# Altium schematic sheet Actuators.SchDoc: Actuators
size A4; Author: Pedro Trenado & Ignacio Cabrera; DrawnBy: Pedro & Ignacio; SheetNumber: 4; Company: ETSI Telecomunicaciones; Address_City: Madrid; Address_Country: Spain; Address_Phone: 910 67 19 00; Address_State_ZIP: 28040; Address_Street: Av. Complutense, 30; TotalSheet: 5; VersionRevision: 1.0; Address_Website: https://www.etsist.upm.es; #NAME@: pedro.trenado@alumnos.upm.es; License: Student
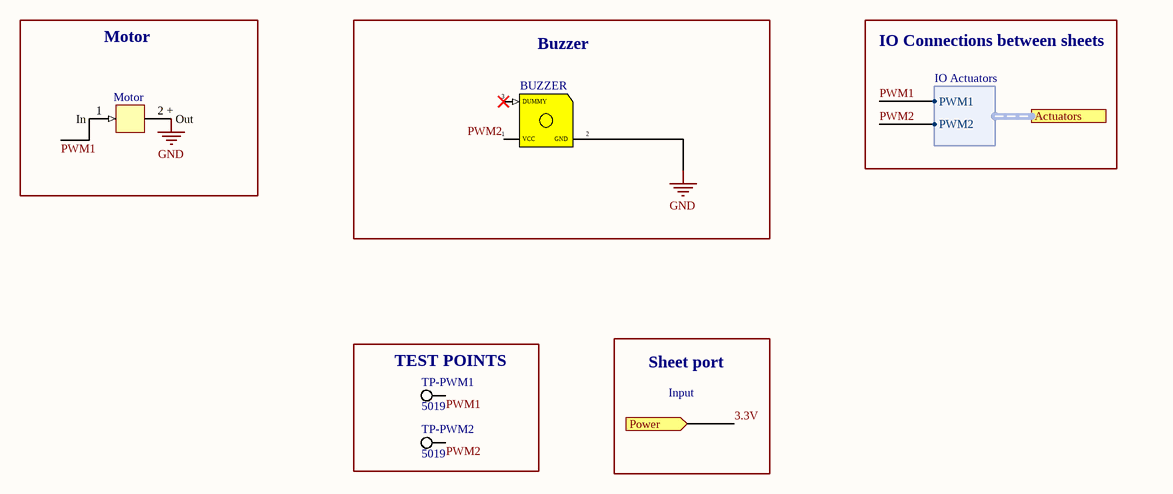
[diagram p0: Actuators.SchDoc]

## Parts
BUZZER  Surface_Mount_Buzzer  [buzzer]  (value not drawn)
IN  MOTOR  [Motor]  (value not drawn)
TP-PWM1  5019  [KSTN-5019_V]
TP-PWM2  5019  [KSTN-5019_V]

## Blocks framed on the sheet
Motor: IN
Buzzer: BUZZER
TEST POINTS: TP-PWM1 TP-PWM2

## Ports
Actuators (harness IO Actuators), Power (in)

## Harnesses
IO Actuators: PWM1, PWM2

## Nets
GND: BUZZER.2(GND) IN.2_+(Out)
3.3V: port Power
PWM1: IN.1(In) TP-PWM1.1 ; port Actuators.PWM1
PWM2: BUZZER.1(VCC) TP-PWM2.1 ; port Actuators.PWM2

Not connected (* = marked no-connect by the designer): BUZZER 3(DUMMY)*

## Notes on the sheet
- IO Connections between sheets
- (near BUZZER) DUMMY  pin not used for any functional purpose.
- Sheet port
- Input
- Title:
- Drawn By:
- Page Contents:
- Checked By:
- Size:
- Date:
- File:
- License:
- Email:
- A4
- Number:
- Time:
- Revision:
- Sheet
- Website:
- of
- (in symbol MOTOR) Motor

## Library data of the parts
BUZZER = Surface_Mount_Buzzer: Company: ETSI Telecomunicaciones
IN = MOTOR: Company: ETSI Telecomunicaciones
TP-PWM1 TP-PWM2 = CMP-1672-00008-1: Test Point, 1 Position SMD, RoHS, Tape and Reel; ComponentLink1Description: Manufacturer URL; Package Quantity: 1000; DatasheetVersion: 03/2014; Packaging: Tape and Reel; ComponentLink2URL: http://www.keyelco.com/product-pdf.cfm?p=1357; ComponentLink1URL: http://www.keyelco.com/; Mount: Surface Mount; Contact Plating: Silver; PackageDescription: 1-Pin Surface Mount Device, Body 3.81 x 2.03 mm; Pins: 1; RoHSCompliant: True; Mounting Technology: Surface Mount; ComponentLink2Description: Datasheet; PackageReference: 5019